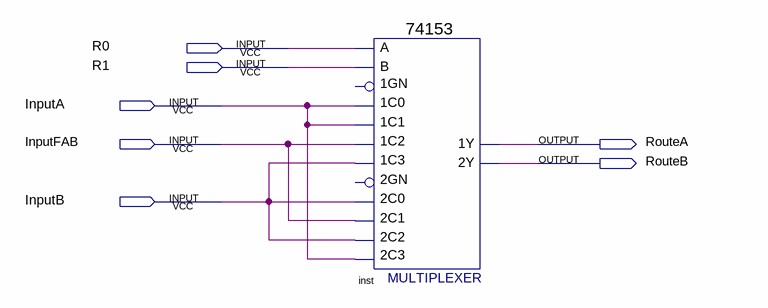
[diagram p0: schematic sheet]
// Quartus schematic RoutingUnit.bdf as structural Verilog: 1 symbols, 7 pins
module RoutingUnit (
  input  R0,
  input  R1,
  input  InputA,
  input  InputFAB,
  input  InputB,
  output RouteA,
  output RouteB
);

  \74153  inst (
    .\1C1 (InputA), .\1C0 (InputA), .\2C0 (InputB), .\2C2 (InputB), .\1C2 (InputFAB), .\1C3 (InputB), .B(R1),
    .A(R0), .\2C1 (InputFAB), .\2C3 (InputA), .\1Y (RouteA), .\2Y (RouteB));  // open: 1GN, 2GN
endmodule
